# Altium project CAN_Hub_PCB_Project.PrjPcb
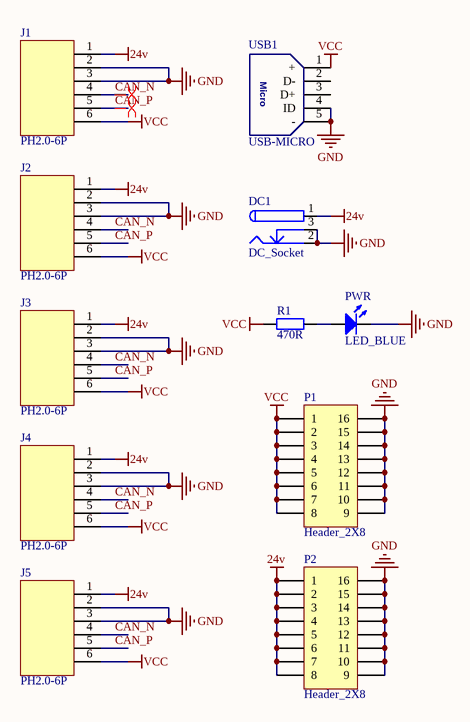
[diagram p0: CAN_Hub.SchDoc]
1 sheet, 11 parts. Net scope: global (net labels, ports and power ports of the same name join across sheets).
Board file: CAN_Hub.PcbDoc

## Sheet CAN_Hub.SchDoc
size A4

### Parts
DC1  DC_Socket  [DC-005]
J1  PH2.0-6P  [PH2.0-6P]
J2  PH2.0-6P  [PH2.0-6P]
J3  PH2.0-6P  [PH2.0-6P]
J4  PH2.0-6P  [PH2.0-6P]
J5  PH2.0-6P  [PH2.0-6P]
P1  Header_2X8  [Header_SMD_2.54X8]
P2  Header_2X8  [Header_SMD_2.54X8]
PWR  LED_BLUE  [LED_0603_B]
R1  470R  [Res-0603]
USB1  USB-MICRO  [USB-MICRO-SMD_C]

### Nets
24v: DC1.1 J1.1 J2.1 J3.1 J4.1 J5.1 P2.1 P2.2 P2.3 P2.4 P2.5 P2.6 P2.7 P2.8
GND: DC1.2 DC1.3 J1.2 J1.3 J2.2 J2.3 J3.2 J3.3 J4.2 J4.3 J5.2 J5.3 P1.9 P1.10 P1.11 P1.12 P1.13 P1.14 P1.15 P1.16 P2.9 P2.10 P2.11 P2.12 P2.13 P2.14 P2.15 P2.16 PWR.2(K) USB1.4(ID) USB1.5(-)
VCC: J1.6 J2.6 J3.6 J4.6 J5.6 P1.1 P1.2 P1.3 P1.4 P1.5 P1.6 P1.7 P1.8 R1.1 USB1.1(+)
CAN_N: J1.4 J2.4 J3.4 J4.4 J5.4
CAN_P: J1.5 J2.5 J3.5 J4.5 J5.5
NetPWR_1: PWR.1(A) R1.2

Not connected (* = marked no-connect by the designer): USB1 2(D-) 3(D+)

### Layout directives
differential pair: CAN_N, CAN_P

### Notes on the sheet
- (in symbol USB-MICRO) Micro

### Library data of the parts
DC1 = DC_Socket: DC电源座
PWR = LED_SMD_BLUE: 发光二极管; ComponentLink1Description: 供应商链接; ComponentLink1URL: http://www.szlcsc.com/product/details_73150.html; Package: 0603; Supplier: LC; SuppliersPartNumber: C72041
R1 = RES: 贴片电阻